# EAGLE schematic pic to fox (EAGLE 4.16)
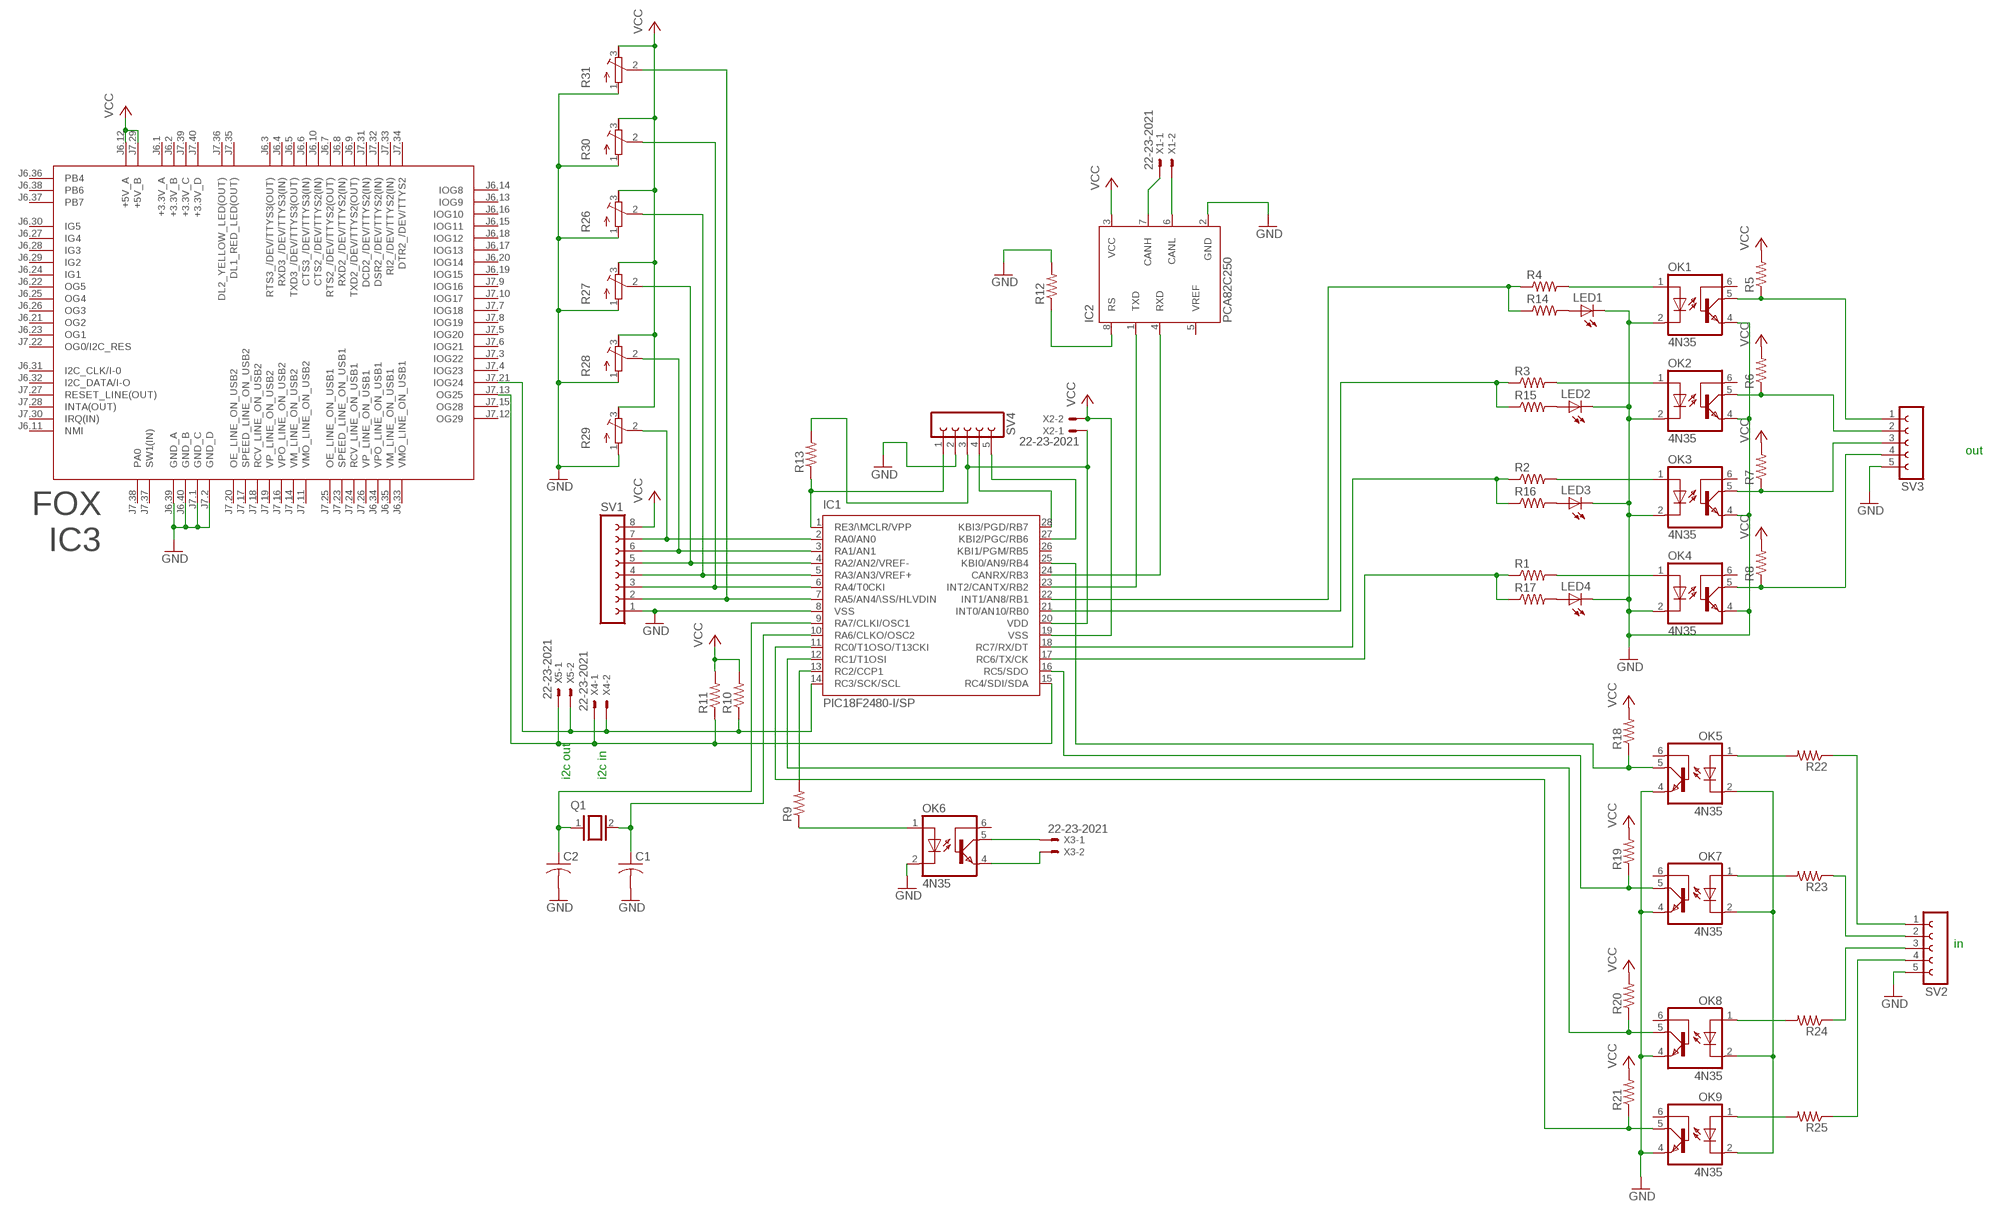
[diagram p0: schematic, sheet 1]

## Parts
C1  C-US025-030X050  [C025-030X050]
C2  C-US025-030X050  [C025-030X050]
IC1  PIC18F2480-I/SP  [DIL28-3]
IC2  PCA82C250  [DIL08]
IC3  FOX  [FOX]
LED1  LEDCHIP-LED0805  [CHIP-LED0805]
LED2  LEDCHIP-LED0805  [CHIP-LED0805]
LED3  LEDCHIP-LED0805  [CHIP-LED0805]
LED4  LEDCHIP-LED0805  [CHIP-LED0805]
OK1  4N35  [DIL06]
OK2  4N35  [DIL06]
OK3  4N35  [DIL06]
OK4  4N35  [DIL06]
OK5  4N35  [DIL06]
OK6  4N35  [DIL06]
OK7  4N35  [DIL06]
OK8  4N35  [DIL06]
OK9  4N35  [DIL06]
Q1  XTAL  [Q]
R1  R-US_0207/2V  [0207/2V]
R2  R-US_0207/2V  [0207/2V]
R3  R-US_0207/2V  [0207/2V]
R4  R-US_0207/2V  [0207/2V]
R5  R-US_0207/2V  [0207/2V]
R6  R-US_0207/2V  [0207/2V]
R7  R-US_0207/2V  [0207/2V]
R8  R-US_0207/2V  [0207/2V]
R9  R-US_0207/2V  [0207/2V]
R10  R-US_0207/2V  [0207/2V]
R11  R-US_0207/2V  [0207/2V]
R12  R-US_0207/2V  [0207/2V]
R13  R-US_0207/5V  [0207/5V]
R14  R-US_0207/2V  [0207/2V]
R15  R-US_0207/2V  [0207/2V]
R16  R-US_0207/2V  [0207/2V]
R17  R-US_0207/2V  [0207/2V]
R18  R-US_0207/2V  [0207/2V]
R19  R-US_0207/2V  [0207/2V]
R20  R-US_0207/2V  [0207/2V]
R21  R-US_0207/2V  [0207/2V]
R22  R-US_0207/2V  [0207/2V]
R23  R-US_0207/2V  [0207/2V]
R24  R-US_0207/2V  [0207/2V]
R25  R-US_0207/2V  [0207/2V]
R26  R-TRIMM4G/J  [RTRIM4G/J]
R27  R-TRIMM4G/J  [RTRIM4G/J]
R28  R-TRIMM4G/J  [RTRIM4G/J]
R29  R-TRIMM4G/J  [RTRIM4G/J]
R30  R-TRIMM4G/J  [RTRIM4G/J]
R31  R-TRIMM4G/J  [RTRIM4G/J]
SV1  FE08-1  [FE08]
SV2  FE05-1  [FE05-1]
SV3  FE05-1  [FE05-1]
SV4  FE05-1  [FE05-1]
X1  22-23-2021  [22-23-2021]
X2  22-23-2021  [22-23-2021]
X3  22-23-2021  [22-23-2021]
X4  22-23-2021  [22-23-2021]
X5  22-23-2021  [22-23-2021]

## Nets
GND: C1.2 C2.2 IC1.8(VSS) IC2.2(GND) IC3.J6.39(GND_A) IC3.J6.40(GND_B) IC3.J7.1(GND_C) IC3.J7.2(GND_D) LED1.C LED2.C LED3.C LED4.C OK1.2(C) OK1.4(EMI) OK2.2(C) OK2.4(EMI) OK3.2(C) OK3.4(EMI) OK4.2(C) OK4.4(EMI) OK5.4(EMI) OK6.2(C) OK7.4(EMI) OK8.4(EMI) OK9.4(EMI) R12.2 R26.1(E) R27.1(E) R28.1(E) R29.1(E) R30.1(E) R31.1(E) SV1.1 SV2.5 SV3.5 SV4.2
N$1: IC1.2(RA0/AN0) R29.2(S) SV1.7
N$2: IC1.3(RA1/AN1) R28.2(S) SV1.6
N$3: IC1.4(RA2/AN2/VREF-) R27.2(S) SV1.5
N$4: IC1.5(RA3/AN3/VREF+) R26.2(S) SV1.4
N$5: IC1.6(RA4/T0CKI) R30.2(S) SV1.3
N$6: OK4.1(A) R1.2
N$7: IC1.11(RC0/T1OSO/T13CKI) OK9.5(COL) R21.1
N$8: IC1.16(RC5/SDO) OK7.5(COL) R19.1
N$10: IC1.7(RA5/AN4/\SS/HLVDIN) R31.2(S) SV1.2
N$11: IC1.15(RC4/SDI/SDA) IC3.J7.13(OG25) R11.1 X4.1 X5.1
N$12: IC1.14(RC3/SCK/SCL) IC3.J7.21(IOG24) R10.1 X4.2 X5.2
N$13: OK3.1(A) R2.2
N$14: OK2.1(A) R3.2
N$15: OK1.1(A) R4.2
N$16: OK3.5(COL) R7.1 SV3.3
N$17: OK4.5(COL) R8.1 SV3.4
N$18: OK2.5(COL) R6.1 SV3.2
N$19: OK1.5(COL) R5.1 SV3.1
N$20: R22.1 SV2.1
N$21: IC1.13(RC2/CCP1) R9.2
N$22: OK6.1(A) R9.1
N$23: IC1.23(INT2/CANTX/RB2) IC2.1(TXD)
N$24: C1.1 IC1.10(RA6/CLKO/OSC2) Q1.2
N$25: C2.1 IC1.9(RA7/CLKI/OSC1) Q1.1
N$26: OK5.2(C) OK7.2(C) OK8.2(C) OK9.2(C)
N$27: IC1.12(RC1/T1OSI) OK8.5(COL) R20.1
N$28: LED1.A R14.2
N$29: IC1.24(CANRX/RB3) IC2.4(RXD)
N$30: LED2.A R15.2
N$31: IC2.6(CANL) X1.2
N$32: IC2.7(CANH) X1.1
N$33: IC2.8(RS) R12.1
N$34: LED3.A R16.2
N$35: IC1.28(KBI3/PGD/RB7) SV4.4
N$36: IC1.27(KBI2/PGC/RB6) SV4.5
N$37: IC1.1(RE3/\MCLR/VPP) R13.1 SV4.1
N$38: IC1.20(VDD) R13.2 SV4.3 X2.1
N$39: LED4.A R17.2
N$40: OK8.1(A) R24.2
N$41: IC1.22(INT1/AN8/RB1) R4.1 R14.1
N$42: IC1.21(INT0/AN10/RB0) R3.1 R15.1
N$43: IC1.18(RC7/RX/DT) R2.1 R16.1
N$44: IC1.17(RC6/TX/CK) R1.1 R17.1
N$45: OK9.1(A) R25.2
N$46: OK7.1(A) R23.2
N$47: OK6.5(COL) X3.1
N$48: OK6.4(EMI) X3.2
N$49: OK5.1(A) R22.2
N$50: IC1.25(KBI0/AN9/RB4) OK5.5(COL) R18.1
N$51: R23.1 SV2.2
N$52: R24.1 SV2.3
N$53: R25.1 SV2.4
VCC: IC1.19(VSS) IC2.3(VCC) IC3.J6.12(+5V_A) IC3.J7.29(+5V_B) R5.2 R6.2 R7.2 R8.2 R10.2 R11.2 R18.2 R19.2 R20.2 R21.2 R26.3(A) R27.3(A) R28.3(A) R29.3(A) R30.3(A) R31.3(A) SV1.8 X2.2
Unconnected: IC1.26(KBI1/PGM/RB5) IC2.5(VREF) IC3.J6.1(+3.3V_A) IC3.J6.2(+3.3V_B) IC3.J6.3(RTS3_/DEV/TTYS3(OUT)) IC3.J6.4(RXD3_/DEV/TTYS3(IN)) IC3.J6.5(TXD3_/DEV/TTYS3(OUT)) IC3.J6.6(CTS3_/DEV/TTYS3(IN)) IC3.J6.7(RTS2_/DEV/TTYS2(OUT)) IC3.J6.8(RXD2_/DEV/TTYS2(IN)) IC3.J6.9(TXD2_/DEV/TTYS2(OUT)) IC3.J6.10(CTS2_/DEV/TTYS2(IN)) IC3.J6.11(NMI) IC3.J6.13(IOG9) IC3.J6.14(IOG8) IC3.J6.15(IOG11) IC3.J6.16(IOG10) IC3.J6.17(IOG13) IC3.J6.18(IOG12) IC3.J6.19(IOG15) IC3.J6.20(IOG14) IC3.J6.21(OG2) IC3.J6.22(OG5) IC3.J6.23(OG1) IC3.J6.24(IG1) IC3.J6.25(OG4) IC3.J6.26(OG3) IC3.J6.27(IG4) IC3.J6.28(IG3) IC3.J6.29(IG2) IC3.J6.30(IG5) IC3.J6.31(I2C_CLK/I-0) IC3.J6.32(I2C_DATA/I-O) IC3.J6.33(VMO_LINE_ON_USB1) IC3.J6.34(VPO_LINE_ON_USB1) IC3.J6.35(VM_LINE_ON_USB1) IC3.J6.36(PB4) IC3.J6.37(PB7) IC3.J6.38(PB6) IC3.J7.3(IOG22) IC3.J7.4(IOG23) IC3.J7.5(IOG20) IC3.J7.6(IOG21) IC3.J7.7(IOG18) IC3.J7.8(IOG19) IC3.J7.9(IOG16) IC3.J7.10(IOG17) IC3.J7.11(VMO_LINE_ON_USB2) IC3.J7.12(OG29) IC3.J7.14(VM_LINE_ON_USB2) IC3.J7.15(OG28) IC3.J7.16(VPO_LINE_ON_USB2) IC3.J7.17(SPEED_LINE_ON_USB2) IC3.J7.18(RCV_LINE_ON_USB2) IC3.J7.19(VP_LINE_ON_USB2) IC3.J7.20(OE_LINE_ON_USB2) IC3.J7.22(OG0/I2C_RES) IC3.J7.23(SPEED_LINE_ON_USB1) IC3.J7.24(RCV_LINE_ON_USB1) IC3.J7.25(OE_LINE_ON_USB1) IC3.J7.26(VP_LINE_ON_USB1) IC3.J7.27(RESET_LINE(OUT)) IC3.J7.28(INTA(OUT)) IC3.J7.30(IRQ(IN)) IC3.J7.31(DCD2_/DEV/TTYS2(IN)) IC3.J7.32(DSR2_/DEV/TTYS2(IN)) IC3.J7.33(RI2_/DEV/TTYS2(IN)) IC3.J7.34(DTR2_/DEV/TTYS2) IC3.J7.35(DL1_RED_LED(OUT)) IC3.J7.36(DL2_YELLOW_LED(OUT)) IC3.J7.37(SW1(IN)) IC3.J7.38(PA0) IC3.J7.39(+3.3V_C) IC3.J7.40(+3.3V_D) OK1.6(BAS) OK2.6(BAS) OK3.6(BAS) OK4.6(BAS) OK5.6(BAS) OK6.6(BAS) OK7.6(BAS) OK8.6(BAS) OK9.6(BAS)

## Notes on the sheet
- out
- i2c out | i2c in
- in

## Library data of the parts
C1 C2 = rcl:C-US: CAPACITOR, American symbol
IC1 = microchip:PIC18F2*80: 28-Pin Enhanced Flash Microcontrollers with ECAN(TM) Technology 10-Bit A/D and nanoWatt Technology Source: http://www.microchip.com .. 39637a.pdf
IC2 = micro-philips:PCA82C250: CAN CONTROLLER INTERFACE
IC3 = aggiunte:FOX: FOXBOARD Un sistema linux embedded completo www.acmesystem.it
LED1-LED4 = led:LED: LED OSRAM: - CHIPLED LG R971, LG N971, LY N971, LG Q971, LY Q971, LO R971, LY R971 LH N974, LH R974 LS Q976, LO Q976, LY Q976 LO Q996 - Hyper CHIPLED LW Q18S LB Q993, LB Q99A, LB R99A - SideLED LS A670, LO A670, LY A670, LG A670, LP A670 LB A673, LV A673, LT A673, LW A673 LH A674 LY A675 LS A676, LA A676, LO A676, LY A676, LW A676 LS A679, LY A679, LG A679 - Hyper Micro SIDELED® LS Y876, LA Y876, LO Y876, LY Y876 LT Y87S - SmartLED LW L88C, LW L88S LB L89C, LB L89S, LG L890 LS L89K, LO L89K, LY L89K LS L896, LA L896, LO L896, LY L896 - TOPLED LS T670, LO T670, LY T670, LG T670, LP T670 LSG T670, LSP T670, LSY T670, LOP T670, LYG T670 LG T671, LOG T671, LSG T671 LB T673, LV T673, LT T673, LW T673 LH T674 LS T676, LA T676, LO T676, LY T676, LB T676, LH T676, LSB T676, LW T676 LB T67C, LV T67C, LT T67C, LS T67K, LO T67K, LY T67K, LW E67C LS E67B, LA E67B, LO E67B, LY E67B, LB E67C, LV E67C, LT E67C LW T67C LS T679, LY T679, LG T679 LS T770, LO T770, LY T770, LG T770, LP T770 LB T773, LV T773, LT T773, LW T773 LH T774 LS E675, LA E675, LY E675, LS T675 LS T776, LA T776, LO T776, LY T776, LB T776 LHGB T686 LT T68C, LB T68C - Hyper Mini TOPLED® LB M676 - Mini TOPLED Santana® LG M470 LS M47K, LO M47K, LY M47K Source: http://www.osram.convergy.de - LUMILED® LXK2-PW12-R00, LXK2-PW12-S00, LXK2-PW14-U00, LXK2-PW14-V00 LXK2-PM12-R00, LXK2-PM12-S00, LXK2-PM14-U00 LXK2-PE12-Q00, LXK2-PE12-R00, LXK2-PE12-S00, LXK2-PE14-T00, LXK2-PE14-U00 LXK2-PB12-K00, LXK2-PB12-L00, LXK2-PB12-M00, LXK2-PB14-N00, LXK2-PB14-P00, LXK2-PB14-Q00 LXK2-PR12-L00, LXK2-PR12-M00, LXK2-PR14-Q00, LXK2-PR14-R00 LXK2-PD12-Q00, LXK2-PD12-R00, LXK2-PD12-S00 LXK2-PH12-R00, LXK2-PH12-S00 LXK2-PL12-P00, LXK2-PL12-Q00, LXK2-PL12-R00 Source: www.luxeon.com
OK1-OK9 = optocoupler:4N35: MOTOROLA OPTO COUPLER
Q1 = special:XTAL: CRYSTAL
R1-R25 = rcl:R-US_: RESISTOR, American symbol
R26-R31 = rcl:R-TRIMM: Trimm resistor
SV1 = con-lsta:FE08-1: FEMALE HEADER
SV2-SV4 = con-lsta:FE05-1: FEMALE HEADER
X1-X5 = con-molex:22-23-2021: .100" (2.54mm) Center Header - 2 Pin